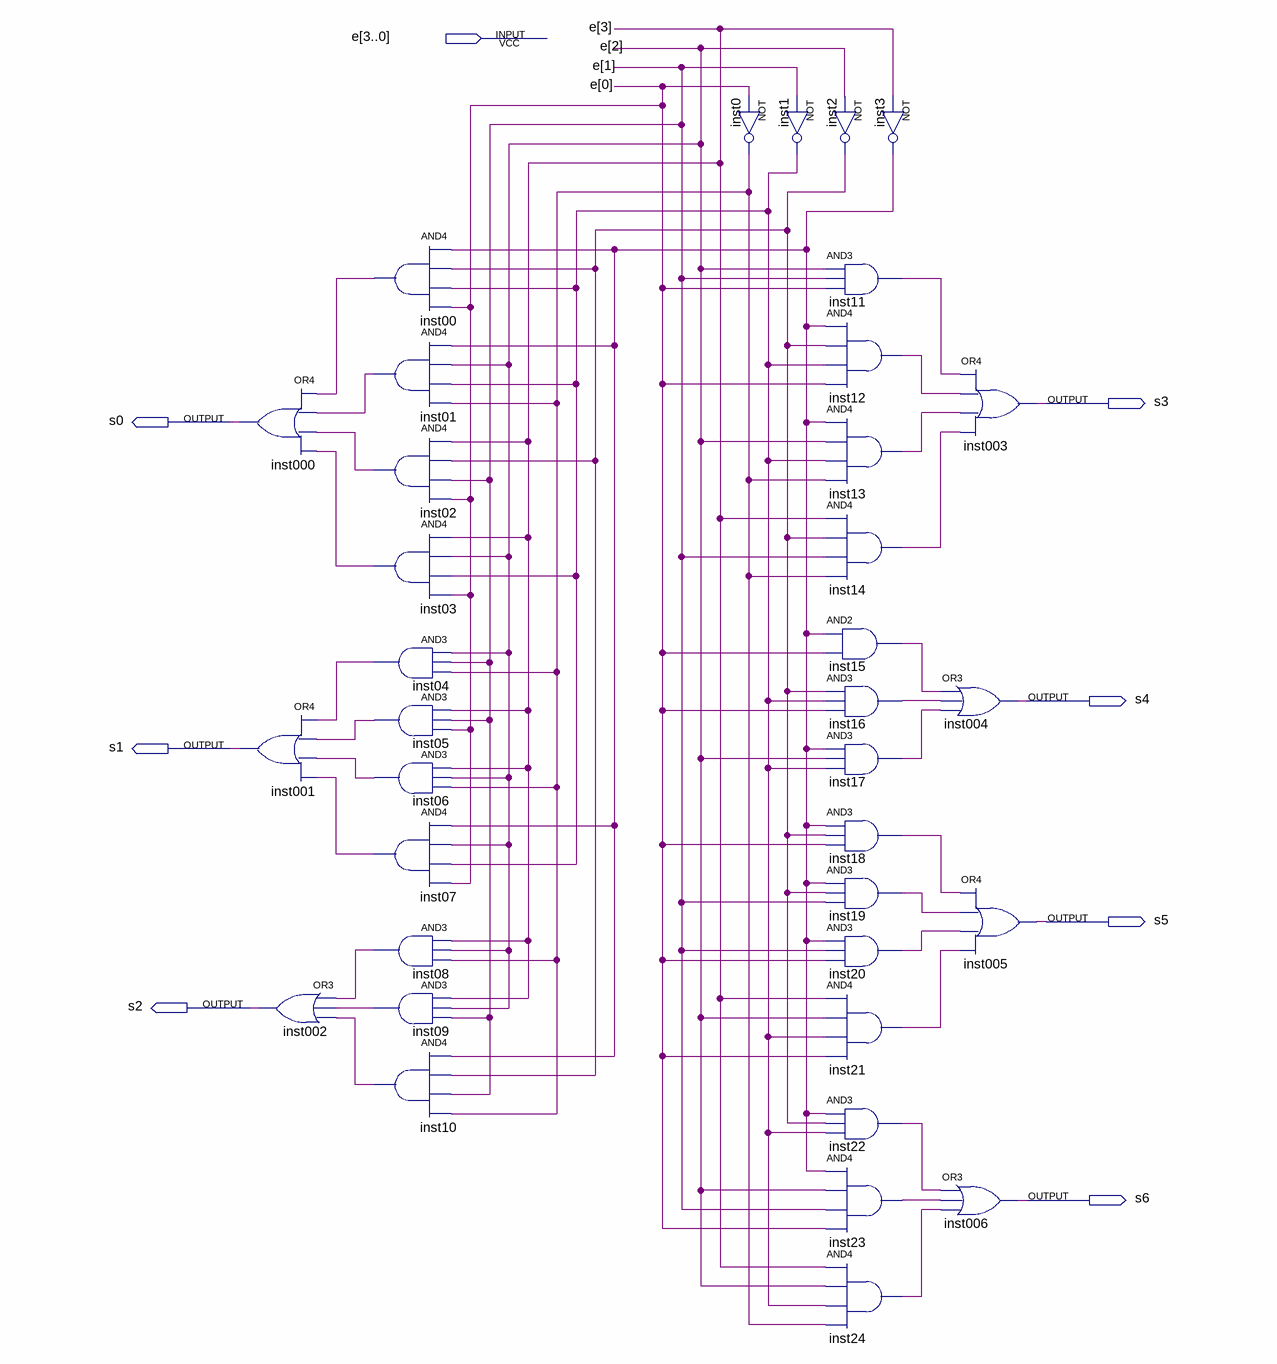
[diagram p0: schematic sheet]
// Quartus schematic 7SEG.bdf as structural Verilog: 36 symbols, 8 pins
module \7SEG  (
  input  [3:0] e,
  output s3,
  output s0,
  output s4,
  output s1,
  output s5,
  output s2,
  output s6
);

  wire inst00_out, inst0_out, inst01_out, inst1_out, inst02_out, inst2_out, inst03_out, inst3_out,
       inst04_out, inst05_out, inst06_out, inst07_out, inst08_out, inst09_out, inst10_out, inst11_out,
       inst12_out, inst13_out, inst14_out, inst15_out, inst16_out, inst17_out, inst18_out, inst19_out,
       inst20_out, inst21_out, inst22_out, inst23_out, inst24_out;

  or inst000 (s0, inst00_out, inst01_out, inst02_out, inst03_out);
  or inst001 (s1, inst04_out, inst05_out, inst06_out, inst07_out);
  or inst002 (s2, inst08_out, inst09_out, inst10_out);
  and inst00 (inst00_out, inst3_out, inst2_out, inst1_out, e[0]);
  and inst01 (inst01_out, inst3_out, e[2], inst1_out, inst0_out);
  and inst02 (inst02_out, e[3], inst2_out, e[1], e[0]);
  and inst03 (inst03_out, e[3], e[2], inst1_out, e[0]);
  and inst04 (inst04_out, e[2], e[1], inst0_out);
  and inst05 (inst05_out, e[3], e[1], e[0]);
  and inst06 (inst06_out, e[3], e[2], inst0_out);
  and inst07 (inst07_out, inst3_out, e[2], inst1_out, e[0]);
  and inst08 (inst08_out, e[3], e[2], inst0_out);
  and inst09 (inst09_out, e[3], e[2], e[1]);
  and inst10 (inst10_out, inst3_out, inst2_out, e[1], inst0_out);
  not inst0 (inst0_out, e[0]);
  not inst1 (inst1_out, e[1]);
  not inst2 (inst2_out, e[2]);
  and inst11 (inst11_out, e[2], e[1], e[0]);
  and inst12 (inst12_out, inst3_out, inst2_out, inst1_out, e[0]);
  and inst13 (inst13_out, inst3_out, e[2], inst1_out, inst0_out);
  and inst14 (inst14_out, e[3], inst2_out, e[1], inst0_out);
  and inst15 (inst15_out, inst3_out, e[0]);
  and inst16 (inst16_out, inst2_out, inst1_out, e[0]);
  and inst17 (inst17_out, inst3_out, e[2], inst1_out);
  and inst18 (inst18_out, inst3_out, inst2_out, e[0]);
  and inst19 (inst19_out, inst3_out, inst2_out, e[1]);
  and inst20 (inst20_out, inst3_out, e[1], e[0]);
  and inst21 (inst21_out, e[3], e[2], inst1_out, e[0]);
  and inst22 (inst22_out, inst3_out, inst2_out, inst1_out);
  and inst23 (inst23_out, inst3_out, e[2], e[1], e[0]);
  and inst24 (inst24_out, e[3], e[2], inst1_out, inst0_out);
  not inst3 (inst3_out, e[3]);
  or inst003 (s3, inst11_out, inst12_out, inst13_out, inst14_out);
  or inst004 (s4, inst15_out, inst16_out, inst17_out);
  or inst005 (s5, inst18_out, inst19_out, inst20_out, inst21_out);
  or inst006 (s6, inst22_out, inst23_out, inst24_out);
endmodule
